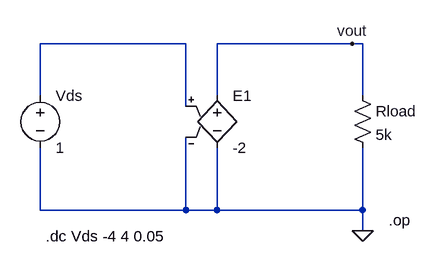
[diagram p0: schematic Draft7.asc]
Draft7.asc, the LTspice schematic file:
Version 4
SHEET 1 880 680
WIRE 400 176 176 176
WIRE 656 176 448 176
WIRE 672 176 656 176
WIRE 176 256 176 176
WIRE 448 256 448 176
WIRE 672 256 672 176
WIRE 400 272 400 176
WIRE 176 432 176 336
WIRE 400 432 400 320
WIRE 400 432 176 432
WIRE 448 432 448 336
WIRE 448 432 400 432
WIRE 672 432 672 336
WIRE 672 432 448 432
WIRE 672 464 672 432
FLAG 672 464 0
FLAG 656 176 vout
SYMBOL voltage 176 240 R0
SYMATTR InstName Vds
SYMATTR Value 1
SYMBOL e 448 240 R0
SYMATTR InstName E1
SYMATTR Value -2
SYMBOL res 656 240 R0
SYMATTR InstName Rload
SYMATTR Value 5k
TEXT 712 448 Left 2 !.op
TEXT 184 472 Left 2 !.dc Vds -4 4 0.05

The netlist it stands for:
* Draft7.asc
Vds N001 0 1
E1 vout 0 N001 0 -2
Rload vout 0 5k
.op
.dc Vds -4 4 0.05
.backanno
.end